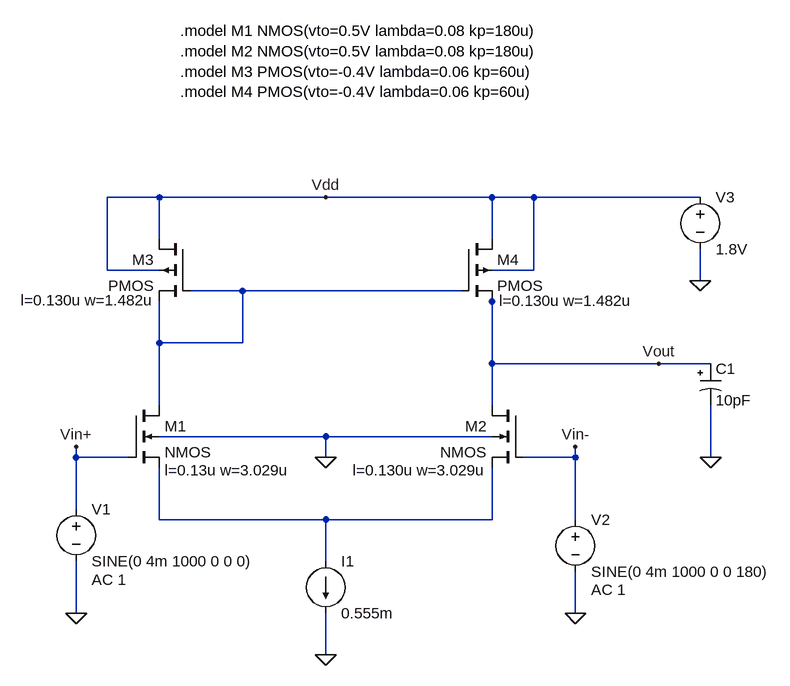
[diagram p0: schematic singlestage.asc]
singlestage.asc, the LTspice schematic file:
Version 4.1
SHEET 1 1124 680
WIRE 160 -192 80 -192
WIRE 416 -192 160 -192
WIRE 672 -192 416 -192
WIRE 736 -192 672 -192
WIRE 992 -192 736 -192
WIRE 160 -128 160 -192
WIRE 672 -128 672 -192
WIRE 80 -80 80 -192
WIRE 160 -80 80 -80
WIRE 736 -80 736 -192
WIRE 736 -80 672 -80
WIRE 992 -64 992 -112
WIRE 288 -48 208 -48
WIRE 624 -48 288 -48
WIRE 672 -32 672 -48
WIRE 160 32 160 -32
WIRE 288 32 288 -48
WIRE 288 32 160 32
WIRE 672 64 672 -32
WIRE 928 64 672 64
WIRE 1008 64 928 64
WIRE 160 128 160 32
WIRE 672 128 672 64
WIRE 416 176 160 176
WIRE 672 176 416 176
WIRE 32 208 32 192
WIRE 112 208 32 208
WIRE 416 208 416 176
WIRE 800 208 800 192
WIRE 800 208 720 208
WIRE 1008 208 1008 128
WIRE 32 288 32 208
WIRE 160 304 160 224
WIRE 416 304 160 304
WIRE 672 304 672 224
WIRE 672 304 416 304
WIRE 800 304 800 208
WIRE 416 368 416 304
WIRE 32 448 32 368
WIRE 800 448 800 384
WIRE 416 512 416 448
FLAG 416 512 0
FLAG 416 208 0
FLAG 32 192 Vin+
FLAG 800 192 Vin-
FLAG 416 -192 Vdd
FLAG 1008 208 0
FLAG 928 64 Vout
FLAG 32 448 0
FLAG 800 448 0
FLAG 992 -64 0
SYMBOL nmos4 112 128 R0
WINDOW 123 56 100 Left 2
SYMATTR InstName M1
SYMATTR Value2 l=0.13u w=3.029u
SYMBOL nmos4 720 128 M0
WINDOW 123 56 100 Left 2
SYMATTR InstName M2
SYMATTR Value2 l=0.130u w=3.029u
SYMBOL pmos4 208 -128 M0
WINDOW 123 55 94 Left 2
SYMATTR InstName M3
SYMATTR Value2 l=0.130u w=1.482u
SYMBOL pmos4 624 -128 R0
WINDOW 123 59 95 Left 2
SYMATTR InstName M4
SYMATTR Value2 l=0.130u w=1.482u
SYMBOL current 416 368 R0
WINDOW 123 0 0 Left 0
WINDOW 39 0 0 Left 0
SYMATTR InstName I1
SYMATTR Value 0.555m
SYMBOL polcap 992 64 R0
SYMATTR InstName C1
SYMATTR Value 10pF
SYMBOL voltage 32 272 R0
WINDOW 123 24 124 Left 2
WINDOW 39 0 0 Left 0
SYMATTR InstName V1
SYMATTR Value SINE(0 4m 1000 0 0 0)
SYMATTR Value2 AC 1
SYMBOL voltage 800 288 R0
WINDOW 123 24 124 Left 2
WINDOW 39 0 0 Left 0
SYMATTR InstName V2
SYMATTR Value SINE(0 4m 1000 0 0 180)
SYMATTR Value2 AC 1
SYMBOL voltage 992 -208 R0
WINDOW 123 0 0 Left 0
WINDOW 39 0 0 Left 0
SYMATTR InstName V3
SYMATTR Value 1.8V
TEXT 192 -448 Left 2 !.model M1 NMOS(vto=0.5V lambda=0.08 kp=180u)\n.model M2 NMOS(vto=0.5V lambda=0.08 kp=180u)\n.model M3 PMOS(vto=-0.4V lambda=0.06 kp=60u)\n.model M4 PMOS(vto=-0.4V lambda=0.06 kp=60u)

The netlist it stands for:
* singlestage.asc
M1 N001 Vin+ N002 0 NMOS l=0.13u w=3.029u
M2 Vout Vin- N002 0 NMOS l=0.130u w=3.029u
M3 Vdd N001 N001 Vdd PMOS l=0.130u w=1.482u
M4 Vdd N001 Vout Vdd PMOS l=0.130u w=1.482u
I1 N002 0 0.555m
C1 Vout 0 10pF
V1 Vin+ 0 SINE(0 4m 1000 0 0 0) AC 1
V2 Vin- 0 SINE(0 4m 1000 0 0 180) AC 1
V3 Vdd 0 1.8V
.model NMOS NMOS
.model PMOS PMOS
.lib standard.mos
.model M1 NMOS(vto=0.5V lambda=0.08 kp=180u)
.model M2 NMOS(vto=0.5V lambda=0.08 kp=180u)
.model M3 PMOS(vto=-0.4V lambda=0.06 kp=60u)
.model M4 PMOS(vto=-0.4V lambda=0.06 kp=60u)
.backanno
.end